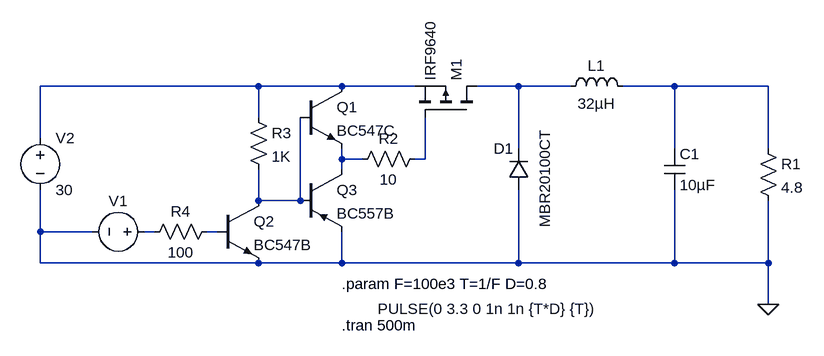
[diagram p0: schematic buck_converter.asc]
buck_converter.asc, the LTspice schematic file:
Version 4.1
SHEET 1 1560 680
WIRE -208 48 -544 48
WIRE -80 48 -208 48
WIRE 32 48 -80 48
WIRE 192 48 128 48
WIRE 272 48 192 48
WIRE 432 48 352 48
WIRE 576 48 432 48
WIRE -208 96 -208 48
WIRE -544 128 -544 48
WIRE 192 144 192 48
WIRE 432 144 432 48
WIRE 576 144 576 48
WIRE -80 160 -80 144
WIRE -48 160 -80 160
WIRE 48 160 48 96
WIRE 48 160 32 160
WIRE -80 176 -80 160
WIRE -208 224 -208 176
WIRE -144 224 -144 96
WIRE -144 224 -208 224
WIRE -544 272 -544 208
WIRE -464 272 -544 272
WIRE -368 272 -384 272
WIRE -272 272 -288 272
WIRE -544 320 -544 272
WIRE -208 320 -544 320
WIRE -80 320 -80 272
WIRE -80 320 -208 320
WIRE 192 320 192 208
WIRE 192 320 -80 320
WIRE 432 320 432 208
WIRE 432 320 192 320
WIRE 576 320 576 224
WIRE 576 320 432 320
WIRE 576 384 576 320
FLAG 576 384 0
SYMBOL diode 208 208 R180
WINDOW 0 24 64 Left 2
WINDOW 3 -24 -58 VRight 2
SYMATTR InstName D1
SYMATTR Value MBR20100CT
SYMBOL ind 256 64 R270
WINDOW 0 32 56 VTop 2
WINDOW 3 5 56 VBottom 2
SYMATTR InstName L1
SYMATTR Value 32µH
SYMBOL cap 416 144 R0
SYMATTR InstName C1
SYMATTR Value 10µF
SYMBOL res 560 128 R0
SYMATTR InstName R1
SYMATTR Value 4.8
SYMBOL pmos 128 96 M270
SYMATTR InstName M1
SYMATTR Value IRF9640
SYMBOL npn -144 48 R0
SYMATTR InstName Q1
SYMATTR Value BC547C
SYMBOL npn -272 224 R0
SYMATTR InstName Q2
SYMATTR Value BC547B
SYMBOL pnp -144 176 R0
SYMATTR InstName Q3
SYMATTR Value BC557B
SYMBOL res 48 144 R90
WINDOW 0 0 56 VBottom 2
WINDOW 3 32 56 VTop 2
SYMATTR InstName R2
SYMATTR Value 10
SYMBOL res -224 80 R0
SYMATTR InstName R3
SYMATTR Value 1K
SYMBOL res -272 256 R90
WINDOW 0 0 56 VBottom 2
WINDOW 3 32 56 VTop 2
SYMATTR InstName R4
SYMATTR Value 100
SYMBOL voltage -368 272 R90
WINDOW 0 -32 56 VBottom 2
WINDOW 3 103 -513 VTop 2
WINDOW 123 0 0 Left 0
WINDOW 39 0 0 Left 0
SYMATTR InstName V1
SYMATTR Value PULSE(0 3.3 0 1n 1n {T*D} {T})
SYMBOL voltage -544 112 R0
WINDOW 123 0 0 Left 0
WINDOW 39 0 0 Left 0
SYMATTR InstName V2
SYMATTR Value 30
TEXT -80 352 Left 2 !.param F=100e3 T=1/F D=0.8
TEXT -80 416 Left 2 !.tran 500m

The netlist it stands for:
* buck_converter.asc
D1 0 N002 MBR20100CT
L1 N002 N003 32µH
C1 N003 0 10µF
R1 N003 0 4.8
M1 N002 N005 N001 N001 IRF9640
Q1 N001 N006 N004 0 BC547C
Q2 N006 N008 0 0 BC547B
Q3 N004 N006 0 0 BC557B
R2 N005 N004 10
R3 N001 N006 1K
R4 N008 N007 100
V1 N007 0 PULSE(0 3.3 0 1n 1n {T*D} {T})
V2 N001 0 30
.model D D
.lib standard.dio
.model NPN NPN
.model PNP PNP
.lib standard.bjt
.model NMOS NMOS
.model PMOS PMOS
.lib standard.mos
.param F=100e3 T=1/F D=0.8
.tran 500m
.backanno
.end